# Altium schematic sheet PA_Channel.SchDoc
size A4
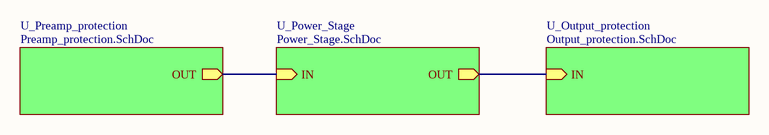
[diagram p0: PA_Channel.SchDoc]

## Sub-sheets
U_Output_protection = Output_protection.SchDoc: IN (in)
U_Power_Stage = Power_Stage.SchDoc: IN (in), OUT (out)
U_Preamp_protection = Preamp_protection.SchDoc: OUT (out)

## Nets
(unnamed): sheet U_Output_protection/IN, sheet U_Power_Stage/OUT
(unnamed): sheet U_Power_Stage/IN, sheet U_Preamp_protection/OUT